# Altium schematic sheet sdram.SchDoc
size A3; SheetNumber: 5; SheetTotal: 5
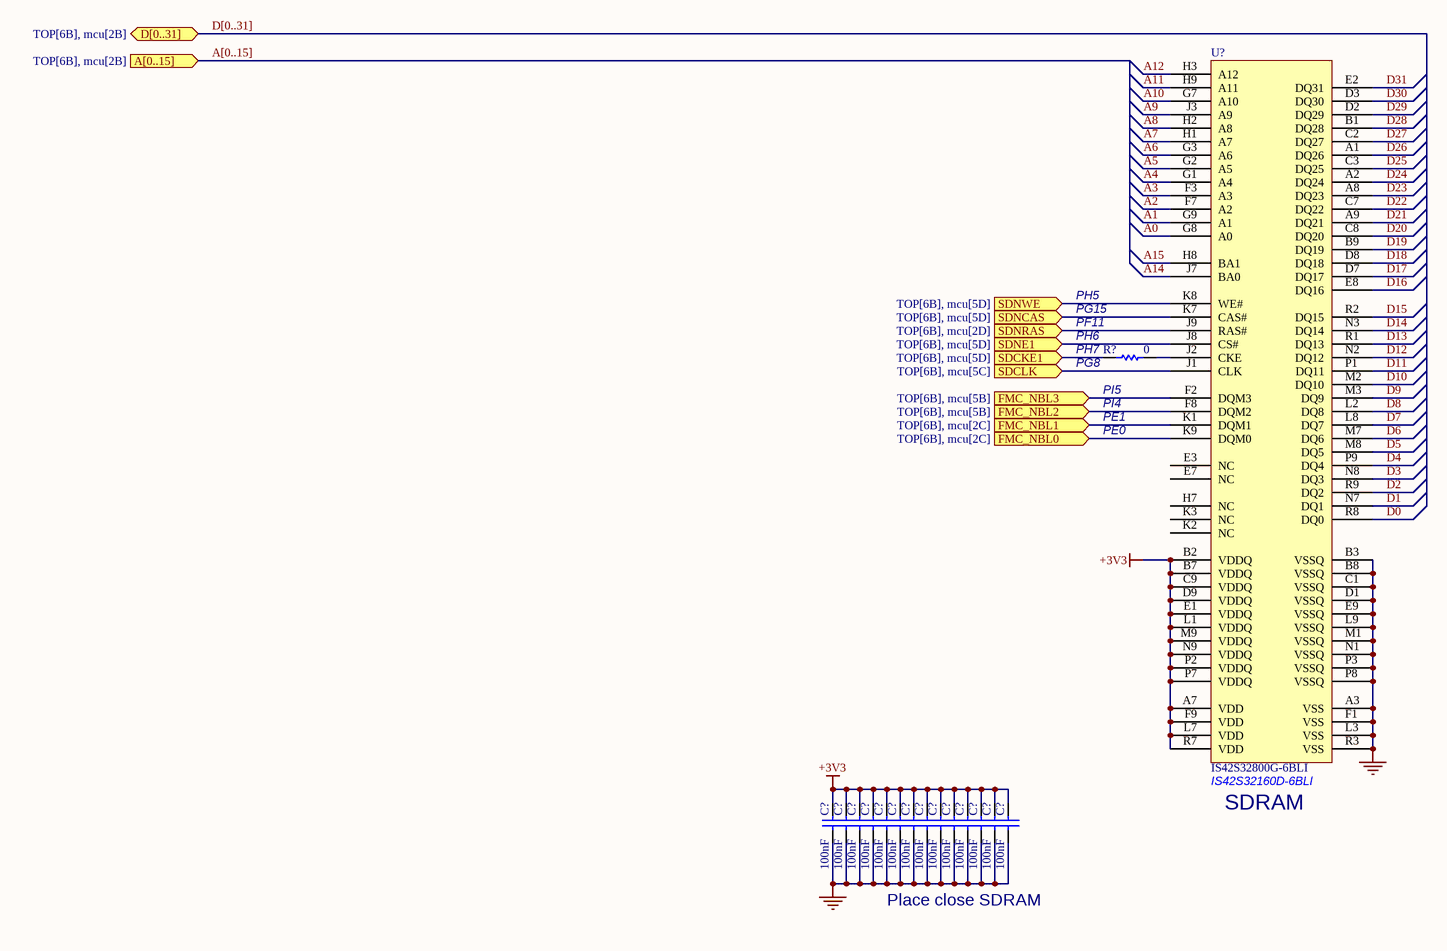
[diagram p0: sdram.SchDoc]

## Parts
(Parts that share a designator on the sheet are numbered #1, #2 ... from top to bottom, then left to right.)
C?#1  100nF  [0603C]
C?#2  100nF  [0603C]
C?#3  100nF  [0603C]
C?#4  100nF  [0603C]
C?#5  100nF  [0603C]
C?#6  100nF  [0603C]
C?#7  100nF  [0603C]
C?#8  100nF  [0603C]
C?#9  100nF  [0603C]
C?#10  100nF  [0603C]
C?#11  100nF  [0603C]
C?#12  100nF  [0603C]
C?#13  100nF  [0603C]
C?#14  100nF  [0603C]
R?  0  [0603R]
U?  IS42S32800G-6BLI  [TFBGA90_8X13]

## Ports
A[0..15] (in, see TOP[6B], mcu[2B]), D[0..31] (bidir, see TOP[6B], mcu[2B]), FMC_NBL0 (in, see TOP[6B], mcu[2C]), FMC_NBL1 (in, see TOP[6B], mcu[2C]), FMC_NBL2 (in, see TOP[6B], mcu[5B]), FMC_NBL3 (in, see TOP[6B], mcu[5B]), SDCKE1 (in, see TOP[6B], mcu[5D]), SDCLK (in, see TOP[6B], mcu[5C]), SDNCAS (in, see TOP[6B], mcu[5D]), SDNE1 (in, see TOP[6B], mcu[5D]), SDNRAS (in, see TOP[6B], mcu[2D]), SDNWE (in, see TOP[6B], mcu[5D])

## Nets
+3V3: C?#1.1 C?#2.1 C?#3.1 C?#4.1 C?#5.1 C?#6.1 C?#7.1 C?#8.1 C?#9.1 C?#10.1 C?#11.1 C?#12.1 C?#13.1 C?#14.1 U?.A7(VDD) U?.B2(VDDQ) U?.B7(VDDQ) U?.C9(VDDQ) U?.D9(VDDQ) U?.E1(VDDQ) U?.F9(VDD) U?.L1(VDDQ) U?.L7(VDD) U?.M9(VDDQ) U?.N9(VDDQ) U?.P2(VDDQ) U?.P7(VDDQ) U?.R7(VDD)
GND: C?#1.2 C?#2.2 C?#3.2 C?#4.2 C?#5.2 C?#6.2 C?#7.2 C?#8.2 C?#9.2 C?#10.2 C?#11.2 C?#12.2 C?#13.2 C?#14.2 U?.A3(VSS) U?.B3(VSSQ) U?.B8(VSSQ) U?.C1(VSSQ) U?.D1(VSSQ) U?.E9(VSSQ) U?.F1(VSS) U?.L3(VSS) U?.L9(VSSQ) U?.M1(VSSQ) U?.N1(VSSQ) U?.P3(VSSQ) U?.P8(VSSQ) U?.R3(VSS)
A0: U?.G8(A0)
A1: U?.G9(A1)
A2: U?.F7(A2)
A3: U?.F3(A3)
A4: U?.G1(A4)
A5: U?.G2(A5)
A6: U?.G3(A6)
A7: U?.H1(A7)
A8: U?.H2(A8)
A9: U?.J3(A9)
A10: U?.G7(A10)
A11: U?.H9(A11)
A12: U?.H3(A12)
A14: U?.J7(BA0)
A15: U?.H8(BA1)
D0: U?.R8(DQ0)
D1: U?.N7(DQ1)
D2: U?.R9(DQ2)
D3: U?.N8(DQ3)
D4: U?.P9(DQ4)
D5: U?.M8(DQ5)
D6: U?.M7(DQ6)
D7: U?.L8(DQ7)
D8: U?.L2(DQ8)
D9: U?.M3(DQ9)
D10: U?.M2(DQ10)
D11: U?.P1(DQ11)
D12: U?.N2(DQ12)
D13: U?.R1(DQ13)
D14: U?.N3(DQ14)
D15: U?.R2(DQ15)
D16: U?.E8(DQ16)
D17: U?.D7(DQ17)
D18: U?.D8(DQ18)
D19: U?.B9(DQ19)
D20: U?.C8(DQ20)
D21: U?.A9(DQ21)
D22: U?.C7(DQ22)
D23: U?.A8(DQ23)
D24: U?.A2(DQ24)
D25: U?.C3(DQ25)
D26: U?.A1(DQ26)
D27: U?.C2(DQ27)
D28: U?.B1(DQ28)
D29: U?.D2(DQ29)
D30: U?.D3(DQ30)
D31: U?.E2(DQ31)
FMC_NBL0: U?.K9(DQM0) ; port FMC_NBL0
FMC_NBL1: U?.K1(DQM1) ; port FMC_NBL1
FMC_NBL2: U?.F8(DQM2) ; port FMC_NBL2
FMC_NBL3: U?.F2(DQM3) ; port FMC_NBL3
SDCKE1: R?.2 ; port SDCKE1
SDCLK: U?.J1(CLK) ; port SDCLK
SDNCAS: U?.K7(CAS#) ; port SDNCAS
SDNE1: U?.J8(CS#) ; port SDNE1
SDNRAS: U?.J9(RAS#) ; port SDNRAS
SDNWE: U?.K8(WE#) ; port SDNWE
NetR?_1: R?.1 U?.J2(CKE)

Not connected (* = marked no-connect by the designer): U? E3(NC) E7(NC) H7(NC) K2(NC) K3(NC)

## Buses and harness runs
bus A[0..15] = port A[0..15]
bus D[0..31] = port D[0..31]

## Notes on the sheet
- PH5
- (near R?) PG15
- (near R?) PF11
- (near R?) PH6
- (near R?) PH7
- (near R?) PG8
- (near R?) PI5
- PE1
- PE0
- (near R?) PI4
- (near U?) IS42S32160D-6BLI
- (near U?) SDRAM
- Place close SDRAM

## Library data of the parts
C?#1-C?#14 = Cap: Capacitor; Value: 10nF; Published: 8-Jun-2000; Revision: July-2002: Re-released for DXP Platform.; Publisher: Altium Limited
R? = Res1: Resistor; Value: 1K; Published: 8-Jun-2000; Revision: July-2002: Re-released for DXP Platform.; Publisher: Altium Limited
U? = IS42S32160D-6BLI: Manuf_1: ISSI; Fitted: YES; Ordered by: Subcon; ECCN_US/EU: EAR99/NEC; Manuf_Part_1: IS42S32800G-6BLI